# Altium project Embedded_Course_Project.PrjPcb
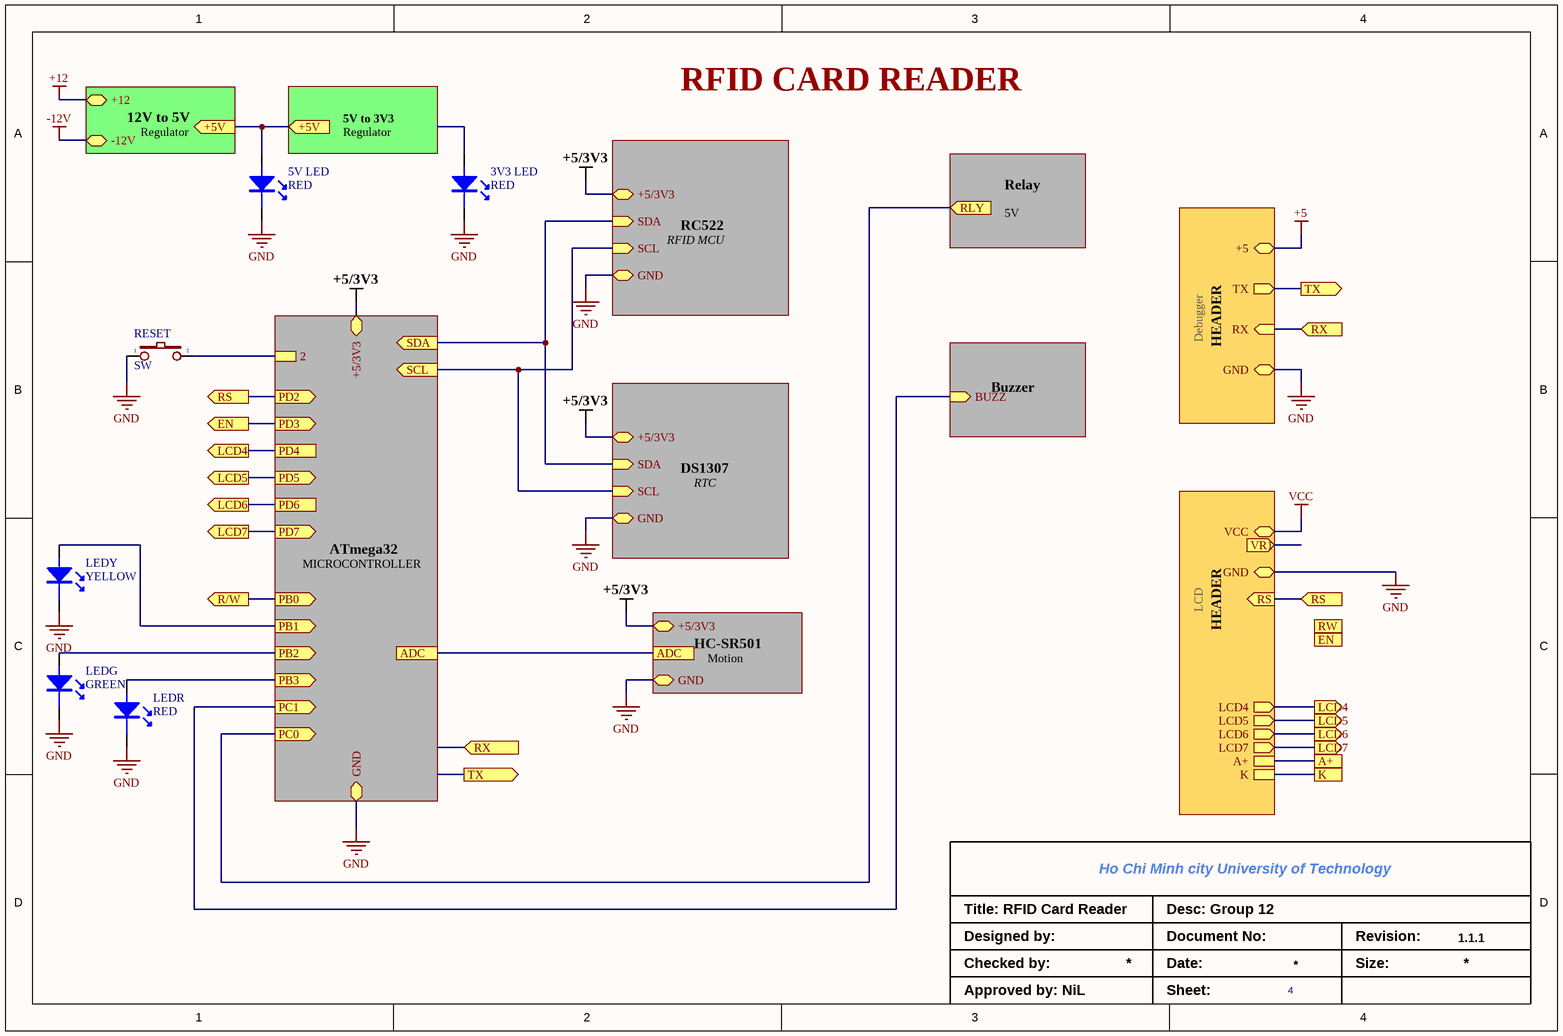
[diagram p0: - BLOCK DIAGRAM.SchDoc]
Version: V1|1; Project: RFID card reader; Group: 12
2 sheets, 43 parts. Net scope: hierarchical (ports join the sheet entries above them; power ports are global).
Board file: PCB.PcbDoc
Sheets:
  - BLOCK DIAGRAM.SchDoc
  - RFID CARD READER SCHEMATIC.SchDoc

## Sheet - BLOCK DIAGRAM.SchDoc
size A4; SheetNumber: 2; SheetTotal: 4; ENG_APP_DATE: --/--/--; DSN_APP_DATE: --/--/--; CHK_APP_DATE: --/--/--

### Parts
(Parts that share a designator on the sheet are numbered #1, #2 ... from top to bottom, then left to right.)
3V3_LED  RED  [CAP10UF]
5V_LED  RED  [CAP10UF]
LEDG  GREEN  [CAP10UF]
LEDR  RED  [CAP10UF]
LEDY  YELLOW  [CAP10UF]
RESET#1  SW  [SW2]

### Sub-sheets
Buzzer = 5V (file not in this document): BUZZ (in)
Debugger = HEADER (file not in this document): RX (in), TX (out), +5 (bidir), GND (bidir)
DS1307 = RTC (file not in this document): SDA (in), SCL (in), +5/3V3 (bidir), GND (bidir)
HC-SR501 = Motion (file not in this document): +5/3V3 (bidir), GND (bidir)
LCD = HEADER (file not in this document): GND (bidir), VCC (bidir), LCD4 (out), LCD5 (out), LCD6 (out), LCD7 (out), A+, K
MICROCONTROLLER = ATmega32 (file not in this document): GND (bidir), +5/3V3 (bidir), 2
RC522 = RFID MCU (file not in this document): SDA (in), SCL (in), +5/3V3 (bidir), GND (bidir)
Regulator = 12V to 5V (file not in this document): -12V (bidir), +12 (bidir)
Regulator = 5V to 3V3 (file not in this document): no entries
Relay = 5V (file not in this document): no entries

### Ports
+5V (in), +5V (out), A+, ADC, EN (out), K, LCD4 (out), LCD5 (out), LCD6 (out), LCD7 (out), PB0 (out), PB1 (out), PB2 (out), PB3 (out), PC0 (out), PC1 (out), PD2 (out), PD3 (out), PD4, PD5 (out), PD6, PD7 (out), R/W (out), RLY (in), RS (in), RS (out), RW (out), RX (in), SCL (out), SDA (out), TX (out), VR1 (in)

### Nets
+5/3V3: sheet MICROCONTROLLER/+5/3V3, sheet RC522/+5/3V3, sheet DS1307/+5/3V3, sheet HC-SR501/+5/3V3
-12V: sheet Regulator/-12V
GND: 3V3_LED.2 5V_LED.2 LEDG.2 LEDR.2 LEDY.2 RESET#1.1 ; sheet MICROCONTROLLER/GND, sheet Debugger/GND, sheet RC522/GND, sheet DS1307/GND, sheet HC-SR501/GND, sheet LCD/GND
Net5V_LED_1: 5V_LED.1 ; port +5V
NetLEDG_1: LEDG.1 ; port PB2
NetLEDR_1: LEDR.1 ; port PB3
NetLEDY_1: LEDY.1 ; port PB1
NetRESET#1_2: RESET#1.2 ; sheet MICROCONTROLLER/2
(unnamed): port RX, sheet Debugger/RX
(unnamed): port TX, sheet Debugger/TX
(unnamed): port SDA, sheet RC522/SDA, sheet DS1307/SDA
(unnamed): port SCL, sheet RC522/SCL, sheet DS1307/SCL
(unnamed): port PC0, port RLY
(unnamed): port PC1, sheet Buzzer/BUZZ
(unnamed): port RS, port PD2
(unnamed): port PD4, port LCD4, sheet LCD/LCD4
(unnamed): port PD5, port LCD5, sheet LCD/LCD5
(unnamed): port PD3, port EN
(unnamed): port PD6, port LCD6, sheet LCD/LCD6
(unnamed): port PD7, port LCD7, sheet LCD/LCD7
(unnamed): port PB0, port R/W
(unnamed): port A+, sheet LCD/A+
(unnamed): port K, sheet LCD/K

Not connected (* = marked no-connect by the designer): 3V3_LED 1

### Notes on the sheet
- RFID CARD READER
- Title: RFID Card Reader
- Ho Chi Minh city University of Technology
- Desc: Group 12
- Designed by:
- Checked by:
- Approved by: NiL
- Date:
- Sheet:
- Document No:
- Revision:
- Size:
- 1.1.1

### Library data of the parts
3V3_LED 5V_LED LEDG LEDR LEDY = LED
RESET#1 = SW2: Switch button 2 pin; Value: SW chip 2 pin

## Sheet - RFID CARD READER SCHEMATIC.SchDoc
size A4; SheetNumber: 3; SheetTotal: 4; ENG_APP_DATE: --/--/--; DSN_APP_DATE: --/--/--; CHK_APP_DATE: --/--/--
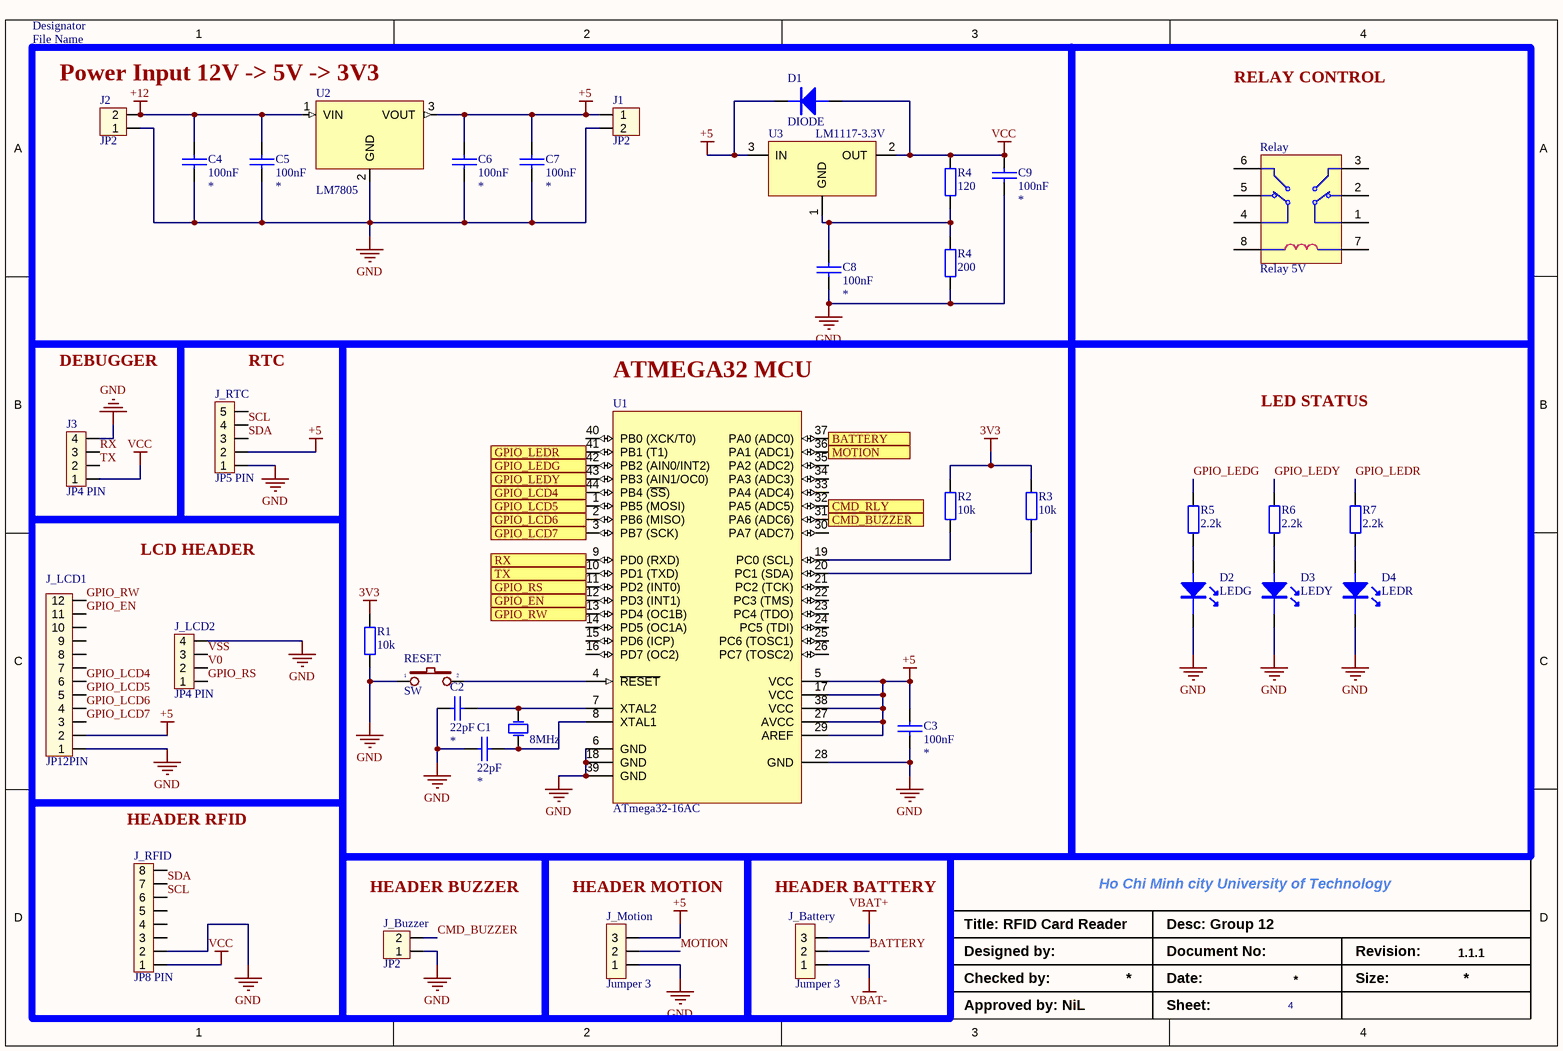
[diagram p1: - RFID CARD READER SCHEMATIC.SchDoc]

### Parts
(Parts that share a designator on the sheet are numbered #1, #2 ... from top to bottom, then left to right.)
C1  22pF  [R1206]
C2  22pF  [R1206]
C3  100nF  [R1206]
C4  100nF  [R1206]
C5  100nF  [R1206]
C6  100nF  [R1206]
C7  100nF  [R1206]
C8  100nF  [R1206]
C9  100nF  [R1206]
D1  DIODE  [diode]
D2  LEDG  [CAP10UF]
D3  LEDY  [CAP10UF]
D4  LEDR  [CAP10UF]
J1  JP2  [CON2]
J2  JP2  [CON2]
J3  JP4 PIN  [JP4]
J_Battery  Jumper 3  [JP3]
J_Buzzer  JP2  [CON2]
J_LCD1  JP12PIN  [JP12_1]
J_LCD2  JP4 PIN  [JP4]
J_Motion  Jumper 3  [JP3]
J_RFID  JP8 PIN  [JP8]
J_RTC  JP5 PIN  [JP5]
R1  10k  [R1/4W]
R2  10k  [R1/4W]
R3  10k  [R1/4W]
R4#1  120  [R1/4W]
R4#2  200  [R1/4W]
R5  2.2k  [R1/4W]
R6  2.2k  [R1/4W]
R7  2.2k  [R1/4W]
Relay  Relay 5V  [Relay 12V]
RESET#2  SW  [SW2]
U1  ATmega32-16AC  [44A_N]
U2  LM7805  [TO-220]
U3  LM1117-3.3V  [SOT223-4N]
Y?  8MHz  [XT2]

### Sub-sheets
Designator = ATMEGA32 MCU (file not in this document): no entries
Designator = File Name (file not in this document): no entries
Designator = DEBUGGER (file not in this document): no entries
Designator = RTC (file not in this document): no entries
Designator = LCD HEADER (file not in this document): no entries
Designator = HEADER RFID (file not in this document): no entries
Designator = LED STATUS (file not in this document): no entries
Designator = RELAY CONTROL (file not in this document): no entries
Designator = HEADER BUZZER (file not in this document): no entries
Designator = HEADER MOTION (file not in this document): no entries
Designator = HEADER BATTERY (file not in this document): no entries

### Ports
BATTERY (in), CMD_BUZZER (out), CMD_RLY (out), GPIO_EN (out), GPIO_LCD4 (out), GPIO_LCD5 (out), GPIO_LCD6 (out), GPIO_LCD7 (out), GPIO_LEDG (out), GPIO_LEDR (out), GPIO_LEDY (out), GPIO_RS (out), GPIO_RW (out), MOTION (in), RX (in), TX (out)

### Nets
3V3: R1.2 R2.2 R3.2
+5: C3.2 C6.2 C7.2 D1.2 J1.1 J_LCD1.2 J_Motion.3 J_RTC.2 U1.5(VCC) U1.17(VCC) U1.27(AVCC) U1.29(AREF) U1.38(VCC) U2.3(VOUT) U3.3(IN)
+12: C4.2 C5.2 J2.2 U2.1(VIN)
GND: C1.1 C2.1 C3.1 C4.1 C5.1 C6.1 C7.1 C8.1 C9.1 D2.2 D3.2 D4.2 J1.2 J2.1 J3.4 J_Buzzer.1 J_LCD1.1 J_LCD2.4 J_Motion.1 J_RFID.2 J_RTC.1 R1.1 R4#2.1 RESET#2.1 U1.6(GND) U1.18(GND) U1.28(GND) U1.39(GND) U2.2(GND)
VBAT+: J_Battery.3
VBAT-: J_Battery.1
VCC: C9.2 D1.1 J3.1 J_RFID.1 R4#1.2 U3.2(OUT)
BATTERY: J_Battery.2
CMD_BUZZER: J_Buzzer.2
GPIO_EN: J_LCD1.11
GPIO_LCD4: J_LCD1.6
GPIO_LCD5: J_LCD1.5
GPIO_LCD6: J_LCD1.4
GPIO_LCD7: J_LCD1.3
GPIO_LEDG: R5.2
GPIO_LEDR: R7.2
GPIO_LEDY: R6.2
GPIO_RS: J_LCD2.1
GPIO_RW: J_LCD1.12
MOTION: J_Motion.2
RX: J3.3
SCL: J_RFID.6 J_RTC.4
SDA: J_RFID.7 J_RTC.3
TX: J3.2
V0: J_LCD2.2
VSS: J_LCD2.3
NetC1_2: C1.2 U1.8(XTAL1) Y?.2(OSC2)
NetC2_2: C2.2 U1.7(XTAL2) Y?.1(OSC1)
NetC8_2: C8.2 R4#1.1 R4#2.2 U3.1(GND)
NetD2_1: D2.1 R5.1
NetD3_1: D3.1 R6.1
NetD4_1: D4.1 R7.1
NetR2_1: R2.1 U1.19(PC0_(SCL))
NetR3_1: R3.1 U1.20(PC1_(SDA))
NetRESET#2_2: RESET#2.2 U1.4(~{RESET})
NetU1_1: U1.1(PB5_(MOSI)) ; port GPIO_LCD5
NetU1_2: U1.2(PB6_(MISO)) ; port GPIO_LCD6
NetU1_3: U1.3(PB7_(SCK)) ; port GPIO_LCD7
NetU1_9: U1.9(PD0_(RXD)) ; port RX
NetU1_10: U1.10(PD1_(TXD)) ; port TX
NetU1_11: U1.11(PD2_(INT0)) ; port GPIO_RS
NetU1_12: U1.12(PD3_(INT1)) ; port GPIO_EN
NetU1_13: U1.13(PD4_(OC1B)) ; port GPIO_RW
NetU1_31: U1.31(PA6_(ADC6)) ; port CMD_BUZZER
NetU1_32: U1.32(PA5_(ADC5)) ; port CMD_RLY
NetU1_36: U1.36(PA1_(ADC1)) ; port MOTION
NetU1_37: U1.37(PA0_(ADC0)) ; port BATTERY
NetU1_41: U1.41(PB1_(T1)) ; port GPIO_LEDR
NetU1_42: U1.42(PB2_(AIN0/INT2)) ; port GPIO_LEDG
NetU1_43: U1.43(PB3_(AIN1/OC0)) ; port GPIO_LEDY
NetU1_44: U1.44(PB4_(~{SS})) ; port GPIO_LCD4

Not connected (* = marked no-connect by the designer): J_LCD1 7 8 9 10; J_RFID 3 4 5 8; J_RTC 5; Relay 1 2 3 4 5 6 7 8; U1 14(PD5_(OC1A)) 15(PD6_(ICP)) 16(PD7_(OC2)) 21(PC2_(TCK)) 22(PC3_(TMS)) 23(PC4_(TDO)) 24(PC5_(TDI)) 25(PC6_(TOSC1)) 26(PC7_(TOSC2)) 30(PA7_(ADC7)) 33(PA4_(ADC4)) 34(PA3_(ADC3)) 35(PA2_(ADC2)) 40(PB0_(XCK/T0))

### Notes on the sheet
- Power Input 12V -> 5V -> 3V3
- Title: RFID Card Reader
- Ho Chi Minh city University of Technology
- Desc: Group 12
- Designed by:
- Checked by:
- Approved by: NiL
- Date:
- Sheet:
- Document No:
- Revision:
- Size:
- 1.1.1

### Library data of the parts
C1-C9 = CAP: Capacitor; Footprint: *
D2-D4 = LED
J1 J2 J_Buzzer = CON2: Connector 2; Value: Connector 2
J3 J_LCD2 = JP4: Value: JP4
J_Battery J_Motion = JP3: Value: J3
J_LCD1 = JP12: JP12 PIN; Value: JP12
J_RFID = JP8: Value: JP7
J_RTC = JP5: Value: JP5
R1-R3 R4#1 R4#2 R5-R7 = R1/4W: Resistor 1/4W; Value: R1/4W - 1K
RESET#2 = SW2: as RESET#1 on sheet - BLOCK DIAGRAM
U1 = ATmega32-16AC: 8-Bit AVR Microcontroller with 32K Bytes of In-System Programmable Flash Memory; Published: 17-Sep-2003; LatestRevisionDate: 13-Apr-2006; LatestRevisionNote: IPC-7351 Footprint Added.; DatasheetVersion: 2503C-AVR-10/02; PackageVersion: rev.B, Oct-2001; PackageReference: 44A; Publisher: Altium Limited; PackageDescription: 44-Pin Thin Quad Flat Pack 0.8 mm Pitch; ComponentLink1Description: Manufacturer Link; ComponentLink1URL: http://www.atmel.com; ComponentLink2Description: Datasheet; ComponentLink2URL: http://www.atmel.com/dyn/resources/prod_documents/doc2503.pdf
U2 = LM7805: TO-220; Text Field1: 70; Text Field2: 30
U3 = LM1117: 800mA Low-Dropout Linear Regulator; Creator: Nguyen Ba Bien; Website: http://group3i.net
Y? = Crystal: Crystal Oscillator; Published: 8-Jun-2000; LatestRevisionDate: 17-Jul-2002; LatestRevisionNote: Re-released for DXP Platform.; PackageReference: R38; Publisher: Altium Limited

## Nets that join several sheets
GND: - BLOCK DIAGRAM (6 pins), - RFID CARD READER SCHEMATIC (29 pins)